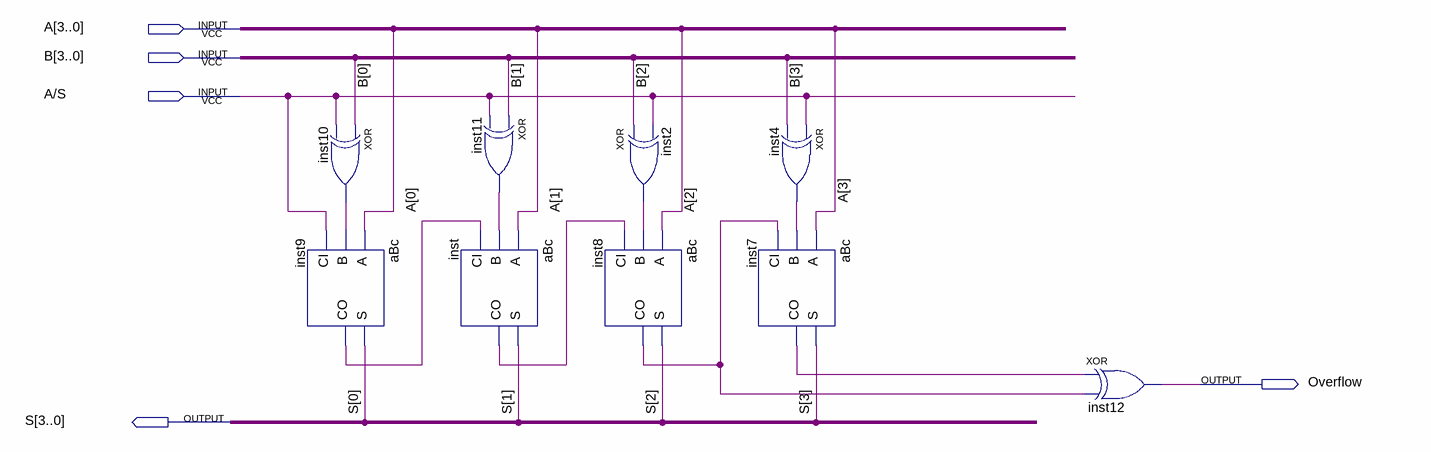
[diagram p0: schematic sheet]
// Quartus schematic AddSub.bdf as structural Verilog: 9 symbols, 5 pins
module AddSub (
  input  [3:0] A,
  input  [3:0] B,
  input  \A/S ,
  output Overflow,
  output [3:0] S
);

  wire inst2_out, inst4_out, inst7_co, inst8_co, inst9_co, inst10_out, inst11_out, inst_co;

  xor inst10 (inst10_out, B[0], \A/S );
  aBc inst9 (.A(A[0]), .B(inst10_out), .CI(\A/S ), .S(S[0]), .CO(inst9_co));
  xor inst11 (inst11_out, B[1], \A/S );
  aBc inst (.A(A[1]), .B(inst11_out), .CI(inst9_co), .S(S[1]), .CO(inst_co));
  xor inst2 (inst2_out, B[2], \A/S );
  aBc inst8 (.A(A[2]), .B(inst2_out), .CI(inst_co), .S(S[2]), .CO(inst8_co));
  xor inst4 (inst4_out, \A/S , B[3]);
  aBc inst7 (.A(A[3]), .B(inst4_out), .CI(inst8_co), .S(S[3]), .CO(inst7_co));
  xor inst12 (Overflow, inst7_co, inst8_co);
endmodule
